# Altium project ARIA.PrjPcb
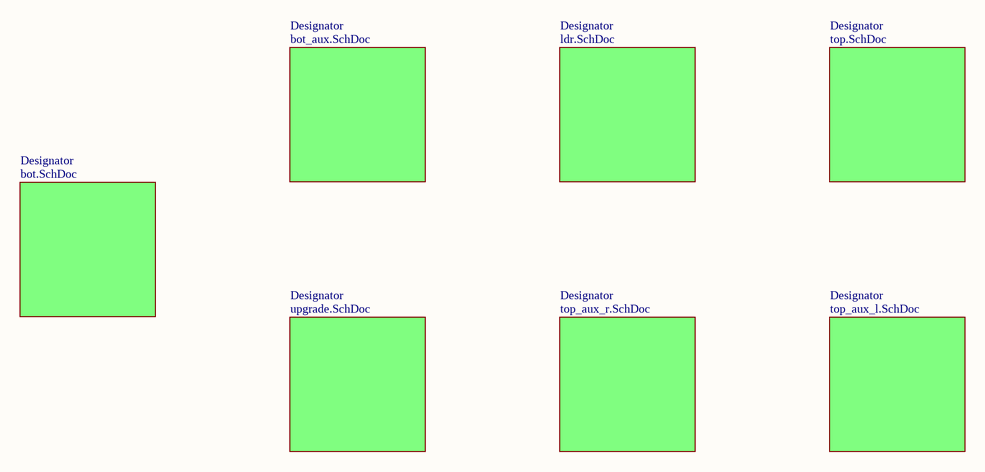
[diagram p0: master.SchDoc]
8 sheets, 96 parts. Net scope: flat (ports and power ports of the same name join across sheets).
Board files: master.PcbDoc, MadhurLDR.PcbDoc
Sheets:
  master.SchDoc
    Designator = bot_aux.SchDoc
    Designator = upgrade.SchDoc
    Designator = top_aux_r.SchDoc
    Designator = ldr.SchDoc
    Designator = top.SchDoc
    Designator = top_aux_l.SchDoc
    Designator = bot.SchDoc

## Sheet master.SchDoc
size A4; SheetNumber: 1; SheetTotal: 8

### Sub-sheets
Designator = bot_aux.SchDoc: no entries
Designator = upgrade.SchDoc: no entries
Designator = top_aux_r.SchDoc: no entries
Designator = ldr.SchDoc: no entries
Designator = top.SchDoc: no entries
Designator = top_aux_l.SchDoc: no entries
Designator = bot.SchDoc: no entries

## Sheet bot_aux.SchDoc
size A4; SheetNumber: 3; SheetTotal: 8
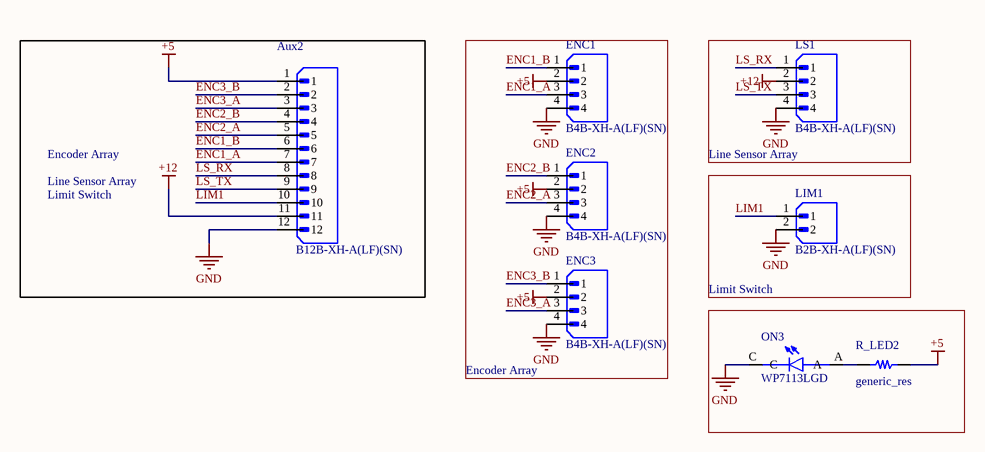
[diagram p1: bot_aux.SchDoc]

### Parts
Aux2  B12B-XH-A(LF)(SN)  [JST_B12B-XH-A(LF)(SN)]
ENC1  B4B-XH-A(LF)(SN)  [JST_B4B-XH-A(LF)(SN)]
ENC2  B4B-XH-A(LF)(SN)  [JST_B4B-XH-A(LF)(SN)]
ENC3  B4B-XH-A(LF)(SN)  [JST_B4B-XH-A(LF)(SN)]
LIM1  B2B-XH-A(LF)(SN)  [JST_B2B-XH-A(LF)(SN)]
LS1  B4B-XH-A(LF)(SN)  [JST_B4B-XH-A(LF)(SN)]
ON3  WP7113LGD  [LED_WP7113LGD]
R_LED2  generic_res  [generic_res_footprint]

### Blocks framed on the sheet
Encoder Array: ENC1-ENC3
Line Sensor Array: LS1
Limit Switch: LIM1

### Nets
+5: Aux2.1 ENC1.2 ENC2.2 ENC3.2 R_LED2.2
+12: Aux2.11 LS1.2
GND: Aux2.12 ENC1.4 ENC2.4 ENC3.4 LIM1.2 LS1.4 ON3.C
ENC1_A: Aux2.7 ENC1.3  [project net ENC1_A_3]
ENC1_B: Aux2.6 ENC1.1  [project net ENC1_B_3]
ENC2_A: Aux2.5 ENC2.3  [project net ENC2_A_3]
ENC2_B: Aux2.4 ENC2.1  [project net ENC2_B_3]
ENC3_A: Aux2.3 ENC3.3  [project net ENC3_A_3]
ENC3_B: Aux2.2 ENC3.1  [project net ENC3_B_3]
LIM1: Aux2.10 LIM1.1  [project net LIM1_3]
LS_RX: Aux2.8 LS1.1  [project net LS_RX_3]
LS_TX: Aux2.9 LS1.3  [project net LS_TX_3]
NetON3_A: ON3.A R_LED2.1

### Notes on the sheet
- Line Sensor Array
- Encoder Array
- Limit Switch

### Library data of the parts
Aux2 = CMP-398-000513-1: Connector Header Through Hole 12 position 0.098 (2.50mm); MF: JST Sales; Package: None; SnapEDA_Link: https://www.snapeda.com/parts/B12B-XH-A(LF)(SN)/JST+Sales+America+Inc./view-part/?ref=snap; Source: B12B-XH-A(LF)(SN).SchLib; Check_prices: https://www.snapeda.com/parts/B12B-XH-A(LF)(SN)/JST+Sales+America+Inc./view-part/?ref=eda; Value: *; Design Item ID: B12B-XH-A(LF)(SN); MP: B12B-XH-A(LF)(SN); Pin Count: 12; Component Type: Standard
ENC1-ENC3 LS1 = CMP-328-000000-1: Connector Header Through Hole 4 position 0.098 (2.50mm); MF: JST Sales; Pin Count: 4; Value: *; Check_prices: https://www.snapeda.com/parts/B4B-XH-A(LF)(SN)/JST+Sales+America+Inc./view-part/?ref=eda; SnapEDA_Link: https://www.snapeda.com/parts/B4B-XH-A(LF)(SN)/JST+Sales+America+Inc./view-part/?ref=snap; MP: B4B-XH-A(LF)(SN); Source: B4B-XH-A(LF)(SN).SchLib; Package: None; Component Type: Standard; Design Item ID: B4B-XH-A(LF)(SN)
LIM1 = CMP-332-000000-1: Connector Header Through Hole 2 position 0.098 (2.50mm); MF: JST Sales America Inc.; Component Type: Standard; Value: *; Check_prices: https://www.snapeda.com/parts/B2B-XH-A(LF)(SN)/JST+Sales+America+Inc./view-part/?ref=eda; Package: None; MP: B2B-XH-A(LF)(SN); SnapEDA_Link: https://www.snapeda.com/parts/B2B-XH-A(LF)(SN)/JST+Sales+America+Inc./view-part/?ref=snap; Pin Count: 2; Source: B2B-XH-A(LF)(SN).SchLib; Design Item ID: B2B-XH-A(LF)(SN)
ON3 = CMP-352-000000-1: Green 568nm LED Indication - Discrete 1.9V Radial; MF: Kingbright; Value: *; Component Type: Standard; Design Item ID: WP7113LGD; Package: Radial Kingbright; Price: None; Source: WP7113LGD.SchLib; SnapEDA_Link: https://www.snapeda.com/parts/WP7113LGD/Kingbright/view-part/?ref=snap; Check_prices: https://www.snapeda.com/parts/WP7113LGD/Kingbright/view-part/?ref=eda; Pin Count: 2; Availability: In Stock; Purchase-URL: https://pricing.snapeda.com/search/part/WP7113LGD/?ref=eda; MP: WP7113LGD
R_LED2 = CMP-340-000000-2: Generic through hole resistor

## Sheet upgrade.SchDoc
size A4; SheetNumber: 7; SheetTotal: 8
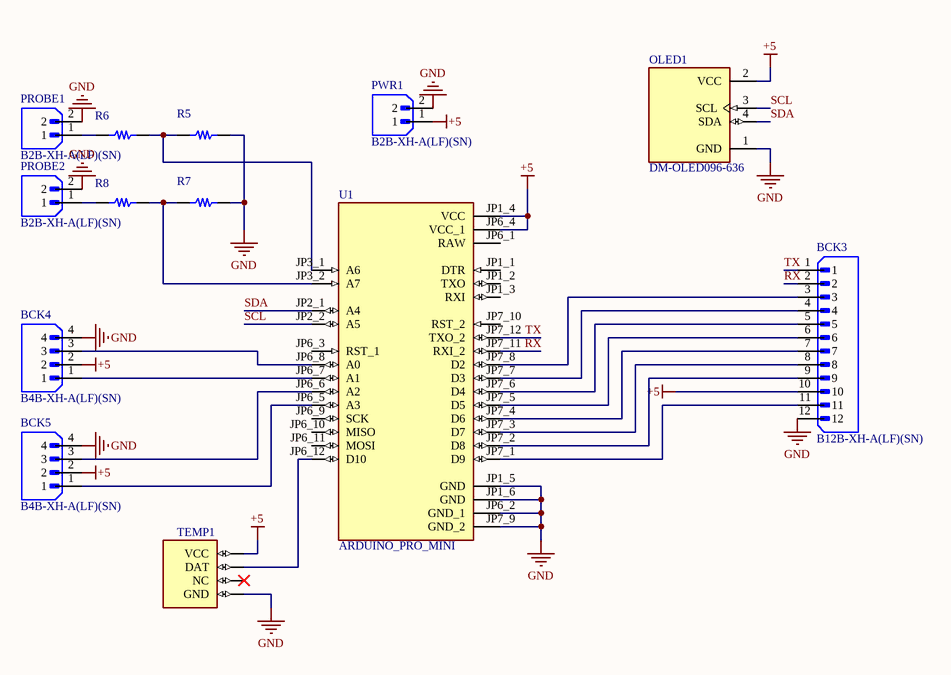
[diagram p2: upgrade.SchDoc]

### Parts
BCK3  B12B-XH-A(LF)(SN)  [JST_B12B-XH-A(LF)(SN)]
BCK4  B4B-XH-A(LF)(SN)  [JST_B4B-XH-A(LF)(SN)]
BCK5  B4B-XH-A(LF)(SN)  [JST_B4B-XH-A(LF)(SN)]
OLED1  DM-OLED096-636  [MODULE_DM-OLED096-636]
PROBE1  B2B-XH-A(LF)(SN)  [JST_B2B-XH-A(LF)(SN)]
PROBE2  B2B-XH-A(LF)(SN)  [JST_B2B-XH-A(LF)(SN)]
PWR1  B2B-XH-A(LF)(SN)  [JST_B2B-XH-A(LF)(SN)]
R5  generic_res  [generic_res_footprint]  (value not drawn)
R6  generic_res  [generic_res_footprint]  (value not drawn)
R7  generic_res  [generic_res_footprint]  (value not drawn)
R8  generic_res  [generic_res_footprint]  (value not drawn)
TEMP1  dht11_symbol  [dht11_footprint]  (value not drawn)
U1  ARDUINO_PRO_MINI  [MODULE_ARDUINO_PRO_MINI]

### Nets
+5: BCK3.10 BCK4.2 BCK5.2 OLED1.2(VCC) PWR1.1 TEMP1.1(VCC) U1.JP1_4(VCC) U1.JP6_4(VCC_1)
GND: BCK3.12 BCK4.4 BCK5.4 OLED1.1(GND) PROBE1.2 PROBE2.2 PWR1.2 R5.1 R7.1 TEMP1.4(GND) U1.JP1_5(GND) U1.JP1_6(GND) U1.JP6_2(GND_1) U1.JP7_9(GND_2)
RX: BCK3.2 U1.JP7_11(RXI_2)  [project net RX_7]
SCL: OLED1.3(SCL) U1.JP2_2(A5)  [project net SCL_7]
SDA: OLED1.4(SDA) U1.JP2_1(A4)  [project net SDA_7]
TX: BCK3.1 U1.JP7_12(TXO_2)  [project net TX_7]
NetBCK3_3: BCK3.3 U1.JP7_8(D2)
NetBCK3_4: BCK3.4 U1.JP7_7(D3)
NetBCK3_5: BCK3.5 U1.JP7_6(D4)
NetBCK3_6: BCK3.6 U1.JP7_5(D5)
NetBCK3_7: BCK3.7 U1.JP7_4(D6)
NetBCK3_8: BCK3.8 U1.JP7_3(D7)
NetBCK3_9: BCK3.9 U1.JP7_2(D8)
NetBCK3_11: BCK3.11 U1.JP7_1(D9)
NetBCK4_1: BCK4.1 U1.JP6_7(A1)
NetBCK4_3: BCK4.3 U1.JP6_8(A0)
NetBCK5_1: BCK5.1 U1.JP6_5(A3)
NetBCK5_3: BCK5.3 U1.JP6_6(A2)
NetPROBE1_1: PROBE1.1 R6.2
NetPROBE2_1: PROBE2.1 R8.2
NetR5_2: R5.2 R6.1 U1.JP3_1(A6)
NetR7_2: R7.2 R8.1 U1.JP3_2(A7)
NetTEMP1_2: TEMP1.2(DAT) U1.JP6_12(D10)

Not connected (* = marked no-connect by the designer): TEMP1 3(NC)*; U1 JP1_1(DTR) JP1_2(TXO) JP1_3(RXI) JP6_1(RAW) JP6_3(RST_1) JP6_9(SCK) JP6_10(MISO) JP6_11(MOSI) JP7_10(RST_2)

### Library data of the parts
BCK3 = CMP-398-000513-1: as Aux2 on sheet bot_aux; Package: None; SnapEDA_Link: https://www.snapeda.com/parts/B12B-XH-A(LF)(SN)/JST+Sales+America+Inc./view-part/?ref=snap; Source: B12B-XH-A(LF)(SN).SchLib; Check_prices: https://www.snapeda.com/parts/B12B-XH-A(LF)(SN)/JST+Sales+America+Inc./view-part/?ref=eda; Value: *; Design Item ID: B12B-XH-A(LF)(SN); MP: B12B-XH-A(LF)(SN); Pin Count: 12; Component Type: Standard
BCK4 BCK5 = CMP-328-000000-1: as ENC1 on sheet bot_aux; Pin Count: 4; Value: *; Check_prices: https://www.snapeda.com/parts/B4B-XH-A(LF)(SN)/JST+Sales+America+Inc./view-part/?ref=eda; SnapEDA_Link: https://www.snapeda.com/parts/B4B-XH-A(LF)(SN)/JST+Sales+America+Inc./view-part/?ref=snap; MP: B4B-XH-A(LF)(SN); Source: B4B-XH-A(LF)(SN).SchLib; Package: None; Component Type: Standard; Design Item ID: B4B-XH-A(LF)(SN)
OLED1 = CMP-410-000000-2: 128 X 64 Monochrome Graphic OLED Display Module; Check_prices: https://www.snapeda.com/parts/DM-OLED096-636/Display+Module/view-part/?ref=eda; Component Type: Standard; Design Item ID: DM-OLED096-636; Value: *; MF: Display Module; Pin Count: 4; SnapEDA_Link: https://www.snapeda.com/parts/DM-OLED096-636/Display+Module/view-part/?ref=snap; Source: DM-OLED096-636.SchLib; MP: DM-OLED096-636; Package: Package
PROBE1 PROBE2 PWR1 = CMP-332-000000-1: as LIM1 on sheet bot_aux; Component Type: Standard; Value: *; Check_prices: https://www.snapeda.com/parts/B2B-XH-A(LF)(SN)/JST+Sales+America+Inc./view-part/?ref=eda; Package: None; MP: B2B-XH-A(LF)(SN); SnapEDA_Link: https://www.snapeda.com/parts/B2B-XH-A(LF)(SN)/JST+Sales+America+Inc./view-part/?ref=snap; Pin Count: 2; Source: B2B-XH-A(LF)(SN).SchLib; Design Item ID: B2B-XH-A(LF)(SN)
R5-R8 = CMP-340-000000-2: Generic through hole resistor
TEMP1 = CMP-00054-3: Humidity, Temperature Digital Â±5% RH Through Hole; MF: UNIVERSAL-SOLDER Electronics Ltd; MP: DHT11; Source: DHT11.SchLib; Pin Count: 3; Component Type: Standard; Package: None; Check_prices: https://www.snapeda.com/parts/DHT11/Ersa/view-part/?ref=eda; Design Item ID: DHT11; SnapEDA_Link: https://www.snapeda.com/parts/DHT11/Ersa/view-part/?ref=snap; Value: *
U1 = CMP-412-000000-1: This board was developed for applications and installations where space is premium and projects are made as permanent set ups. Small, available in 3.3 V and 5 V versions, powered by ATmega328P.; MP: Arduino Pro Mini; Component Type: Standard; Value: *; Pin Count: 34; Check_prices: https://www.snapeda.com/parts/Arduino%20Pro%20Mini/Arduino/view-part/?ref=eda; Package: None; Design Item ID: ARDUINO_PRO_MINI; Source: ARDUINO_PRO_MINI.SchLib; MF: Arduino; SnapEDA_Link: https://www.snapeda.com/parts/Arduino%20Pro%20Mini/Arduino/view-part/?ref=snap

## Sheet top_aux_r.SchDoc
size A4; SheetNumber: 8; SheetTotal: 8
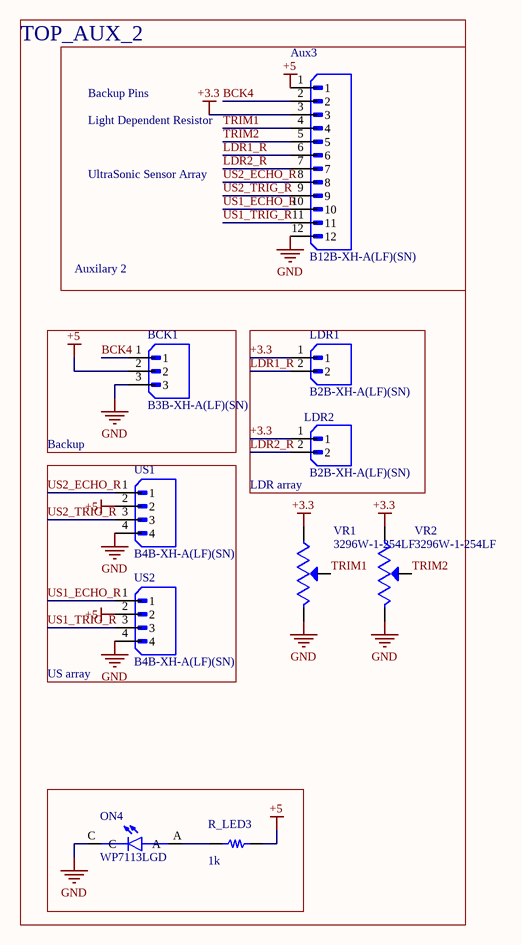
[diagram p3: top_aux_r.SchDoc]

### Parts
(Parts that share a designator on the sheet are numbered #1, #2 ... from top to bottom, then left to right.)
Aux3  B12B-XH-A(LF)(SN)  [JST_B12B-XH-A(LF)(SN)]
BCK1  B3B-XH-A(LF)(SN)  [JST_B3B-XH-A(LF)(SN)]
LDR1#1  B2B-XH-A(LF)(SN)  [JST_B2B-XH-A(LF)(SN)]
LDR2#1  B2B-XH-A(LF)(SN)  [JST_B2B-XH-A(LF)(SN)]
ON4  WP7113LGD  [LED_WP7113LGD]
R_LED3  1k  [generic_res_footprint]
US1  B4B-XH-A(LF)(SN)  [JST_B4B-XH-A(LF)(SN)]
US2  B4B-XH-A(LF)(SN)  [JST_B4B-XH-A(LF)(SN)]
VR1  3296W-1-254LF  [TRIM_3296W-1-254LF]
VR2  3296W-1-254LF  [TRIM_3296W-1-254LF]

### Blocks framed on the sheet
TOP_AUX_2: Aux3 ON4 R_LED3 VR1 VR2
Backup: BCK1
LDR array: LDR1#1 LDR2#1
US array: US1 US2

### Nets
+3.3: Aux3.3 LDR1#1.1 LDR2#1.1 VR1.1(CCW) VR2.1(CCW)
+5: Aux3.1 BCK1.2 R_LED3.2 US1.2 US2.2
GND: Aux3.12 BCK1.3 ON4.C US1.4 US2.4 VR1.3(CW) VR2.3(CW)
BCK4: Aux3.2 BCK1.1  [project net BCK4_8]
LDR1_R: Aux3.6 LDR1#1.2  [project net LDR1_R_8]
LDR2_R: Aux3.7 LDR2#1.2  [project net LDR2_R_8]
TRIM1: Aux3.4 VR1.2(WIPER)  [project net TRIM1_8]
TRIM2: Aux3.5 VR2.2(WIPER)  [project net TRIM2_8]
US1_ECHO_R: Aux3.10 US2.1  [project net US1_ECHO_R_8]
US1_TRIG_R: Aux3.11 US2.3  [project net US1_TRIG_R_8]
US2_ECHO_R: Aux3.8 US1.1  [project net US2_ECHO_R_8]
US2_TRIG_R: Aux3.9 US1.3  [project net US2_TRIG_R_8]
NetON4_A: ON4.A R_LED3.1

### Notes on the sheet
- Backup Pins
- Light Dependent Resistor
- UltraSonic Sensor Array
- Auxilary 2

### Library data of the parts
Aux3 = CMP-398-000513-1: as Aux2 on sheet bot_aux; Package: None; SnapEDA_Link: https://www.snapeda.com/parts/B12B-XH-A(LF)(SN)/JST+Sales+America+Inc./view-part/?ref=snap; Source: B12B-XH-A(LF)(SN).SchLib; Check_prices: https://www.snapeda.com/parts/B12B-XH-A(LF)(SN)/JST+Sales+America+Inc./view-part/?ref=eda; Value: *; Design Item ID: B12B-XH-A(LF)(SN); MP: B12B-XH-A(LF)(SN); Pin Count: 12; Component Type: Standard
BCK1 = CMP-330-000000-1: Connector Header Through Hole 3 position 0.098 (2.50mm); MF: JST Sales; Value: *; Check_prices: https://www.snapeda.com/parts/B3B-XH-A(LF)(SN)/JST+Sales+America+Inc./view-part/?ref=eda; Component Type: Standard; Source: B3B-XH-A(LF)(SN).SchLib; MP: B3B-XH-A(LF)(SN); Design Item ID: B3B-XH-A(LF)(SN); SnapEDA_Link: https://www.snapeda.com/parts/B3B-XH-A(LF)(SN)/JST+Sales+America+Inc./view-part/?ref=snap; Pin Count: 3; Package: None
LDR1#1 LDR2#1 = CMP-332-000000-1: as LIM1 on sheet bot_aux; Component Type: Standard; Value: *; Check_prices: https://www.snapeda.com/parts/B2B-XH-A(LF)(SN)/JST+Sales+America+Inc./view-part/?ref=eda; Package: None; MP: B2B-XH-A(LF)(SN); SnapEDA_Link: https://www.snapeda.com/parts/B2B-XH-A(LF)(SN)/JST+Sales+America+Inc./view-part/?ref=snap; Pin Count: 2; Source: B2B-XH-A(LF)(SN).SchLib; Design Item ID: B2B-XH-A(LF)(SN)
ON4 = CMP-352-000000-1: as ON3 on sheet bot_aux; Value: *; Component Type: Standard; Design Item ID: WP7113LGD; Package: Radial Kingbright; Price: None; Source: WP7113LGD.SchLib; SnapEDA_Link: https://www.snapeda.com/parts/WP7113LGD/Kingbright/view-part/?ref=snap; Check_prices: https://www.snapeda.com/parts/WP7113LGD/Kingbright/view-part/?ref=eda; Pin Count: 2; Availability: In Stock; Purchase-URL: https://pricing.snapeda.com/search/part/WP7113LGD/?ref=eda; MP: WP7113LGD
R_LED3 = CMP-340-000000-2: Generic through hole resistor
US1 US2 = CMP-328-000000-1: as ENC1 on sheet bot_aux; Pin Count: 4; Value: *; Check_prices: https://www.snapeda.com/parts/B4B-XH-A(LF)(SN)/JST+Sales+America+Inc./view-part/?ref=eda; SnapEDA_Link: https://www.snapeda.com/parts/B4B-XH-A(LF)(SN)/JST+Sales+America+Inc./view-part/?ref=snap; MP: B4B-XH-A(LF)(SN); Source: B4B-XH-A(LF)(SN).SchLib; Package: None; Component Type: Standard; Design Item ID: B4B-XH-A(LF)(SN)
VR1 VR2 = CMP-402-000001-1: 250 kOhms 0.5W, 1/2W PC Pins Through Hole Trimmer Potentiometer Cermet 25.0 Turn Top Adjustment; MF: Bourns; Source: 3296W-1-254LF.SchLib; Purchase-URL: https://pricing.snapeda.com/search/part/3296W-1-254LF/?ref=eda; Value: *; Price: None; MP: 3296W-1-254LF; Availability: In Stock; Pin Count: 3; Check_prices: https://www.snapeda.com/parts/3296W-1-254LF/Bourns+-+J.W.+Miller/view-part/?ref=eda; Design Item ID: 3296W-1-254LF; Component Type: Standard; SnapEDA_Link: https://www.snapeda.com/parts/3296W-1-254LF/Bourns+-+J.W.+Miller/view-part/?ref=snap; Package: SOT-23-5 Bourns

## Sheet ldr.SchDoc
size A4; SheetNumber: 6; SheetTotal: 8
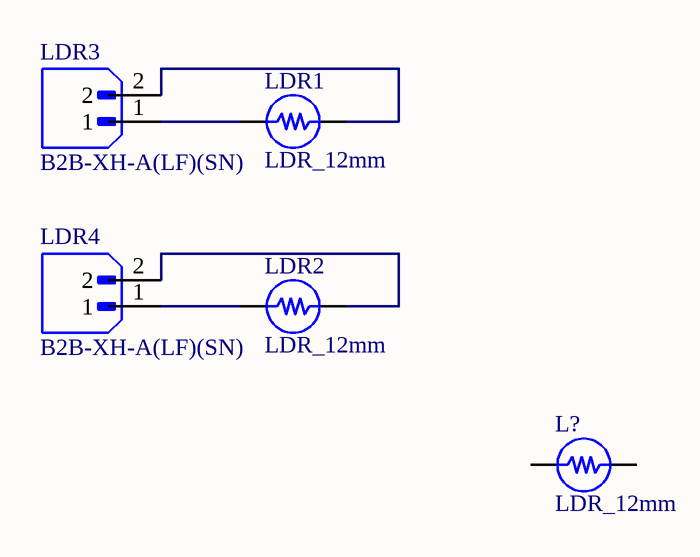
[diagram p4: ldr.SchDoc]

### Parts
(Parts that share a designator on the sheet are numbered #1, #2 ... from top to bottom, then left to right.)
L?  LDR_12mm  [LDR_12mm-Footprint-1]
LDR1#2  LDR_12mm  [LDR_12mm-Footprint-1]
LDR2#2  LDR_12mm  [LDR_12mm-Footprint-1]
LDR3  B2B-XH-A(LF)(SN)  [JST_B2B-XH-A(LF)(SN)]
LDR4  B2B-XH-A(LF)(SN)  [JST_B2B-XH-A(LF)(SN)]

### Nets
NetLDR1#2_1: LDR1#2.1 LDR3.1
NetLDR1#2_2: LDR1#2.2 LDR3.2
NetLDR2#2_1: LDR2#2.1 LDR4.1
NetLDR2#2_2: LDR2#2.2 LDR4.2

Not connected (* = marked no-connect by the designer): L? 1 2

### Library data of the parts
L? LDR1#2 LDR2#2 = CMP-00057-1: 12mm Light Dependant Resistor
LDR3 LDR4 = CMP-332-000000-1: as LIM1 on sheet bot_aux; Component Type: Standard; Value: *; Check_prices: https://www.snapeda.com/parts/B2B-XH-A(LF)(SN)/JST+Sales+America+Inc./view-part/?ref=eda; Package: None; MP: B2B-XH-A(LF)(SN); SnapEDA_Link: https://www.snapeda.com/parts/B2B-XH-A(LF)(SN)/JST+Sales+America+Inc./view-part/?ref=snap; Pin Count: 2; Source: B2B-XH-A(LF)(SN).SchLib; Design Item ID: B2B-XH-A(LF)(SN)

## Sheet top.SchDoc
size 381 x 241 mm; SheetNumber: 4; SheetTotal: 8
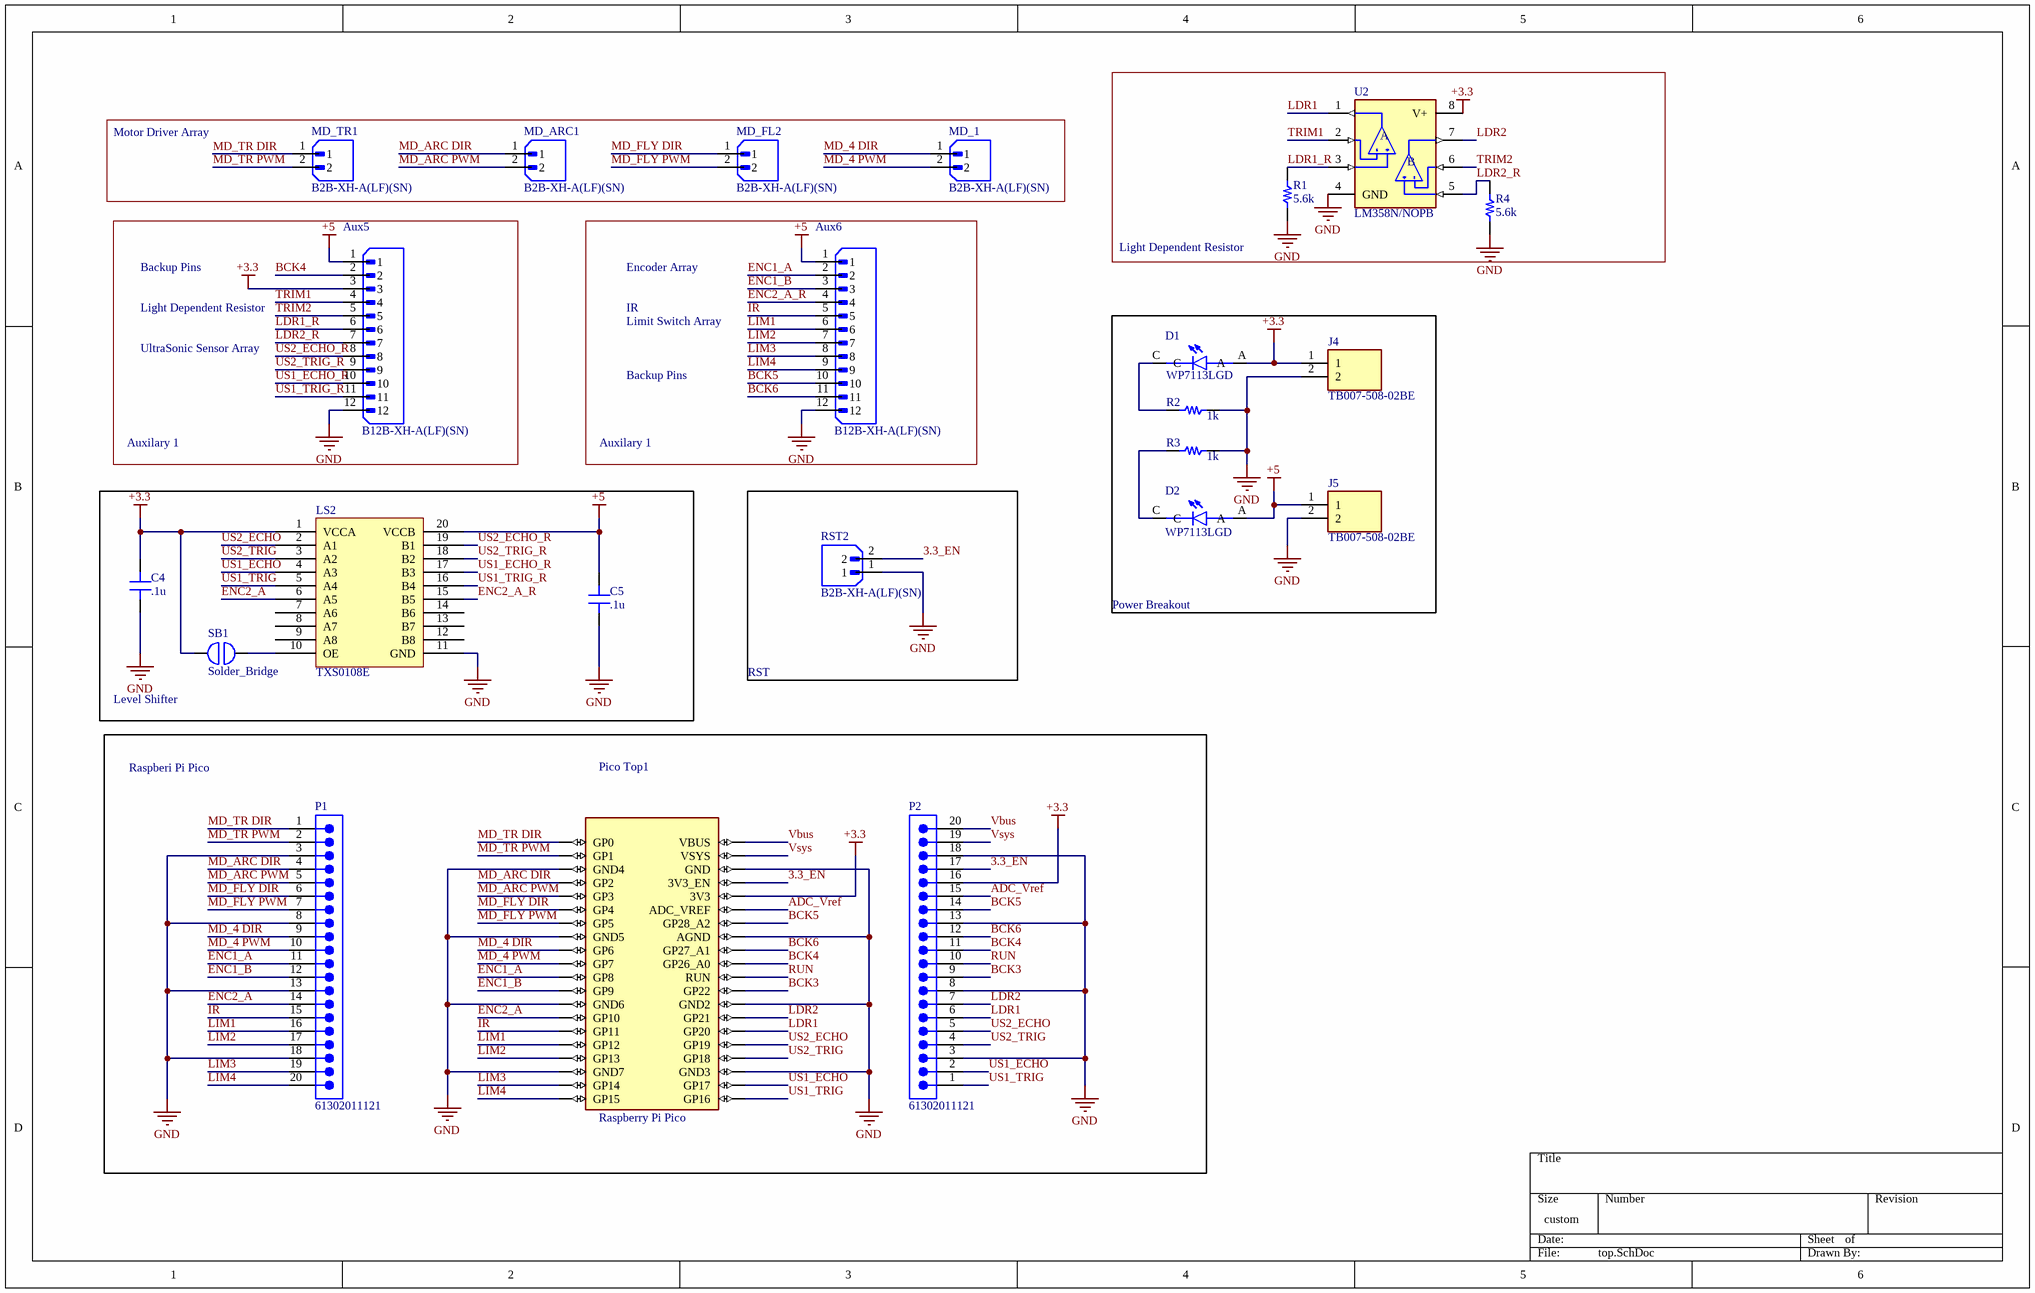
[diagram p5: top.SchDoc]

### Parts
Aux5  B12B-XH-A(LF)(SN)  [JST_B12B-XH-A(LF)(SN)]
Aux6  B12B-XH-A(LF)(SN)  [JST_B12B-XH-A(LF)(SN)]
C4  .1u  [generic_cap]
C5  .1u  [generic_cap]
D1  WP7113LGD  [LED_WP7113LGD]
D2  WP7113LGD  [LED_WP7113LGD]
J4  TB007-508-02BE  [CUI_TB007-508-02BE]
J5  TB007-508-02BE  [CUI_TB007-508-02BE]
LS2  TXS0108E  [TXS0108E footprint]
MD_1  B2B-XH-A(LF)(SN)  [JST_B2B-XH-A(LF)(SN)]
MD_ARC1  B2B-XH-A(LF)(SN)  [JST_B2B-XH-A(LF)(SN)]
MD_FL2  B2B-XH-A(LF)(SN)  [JST_B2B-XH-A(LF)(SN)]
MD_TR1  B2B-XH-A(LF)(SN)  [JST_B2B-XH-A(LF)(SN)]
P1  61302011121  [61302011121]
P2  61302011121  [61302011121]
Pico_Top1  Raspberry Pi Pico  [RASPBERRY_PI_PICO]
R1  5.6k  [generic_res_footprint]
R2  1k  [generic_res_footprint]
R3  1k  [generic_res_footprint]
R4  5.6k  [generic_res_footprint]
RST2  B2B-XH-A(LF)(SN)  [JST_B2B-XH-A(LF)(SN)]
SB1  Solder_Bridge  [Solder_Bridge-Footprint-1]
U2  LM358N/NOPB  [DIP794W45P254L959H508Q8]

### Blocks framed on the sheet
Motor Driver Array: MD_1 MD_ARC1 MD_FL2 MD_TR1
Light Dependent Resistor: R1 R4 U2
Power Breakout: D1 D2 J4 J5 R2 R3
Level Shifter: C4 C5 LS2 SB1
RST: RST2
Raspberi Pi Pico: P1 P2 Pico_Top1

### Nets
+3.3: Aux5.3 C4.2 D1.A J4.1 LS2.1(VCCA) P2.16 Pico_Top1.3V3 SB1.1 U2.8(V+)
+5: Aux5.1 Aux6.1 C5.2 D2.A J5.1 LS2.20(VCCB)
GND: Aux5.12 Aux6.12 C4.1 C5.1 J4.2 J5.2 LS2.11(GND) P1.3 P1.8 P1.13 P1.18 P2.3 P2.8 P2.13 P2.18 Pico_Top1.AGND Pico_Top1.GND Pico_Top1.GND2 Pico_Top1.GND3 Pico_Top1.GND4 Pico_Top1.GND5 Pico_Top1.GND6 Pico_Top1.GND7 R1.1 R2.2 R3.2 R4.1 RST2.1 U2.4(GND)
3.3_EN: P2.17 Pico_Top1.3V3_EN RST2.2  [project net 3.3_EN_4]
ADC_Vref: P2.15 Pico_Top1.ADC_VREF  [project net ADC_Vref_4]
BCK3: P2.9 Pico_Top1.GP22  [project net BCK3_4]
BCK4: Aux5.2 P2.11 Pico_Top1.GP26_A0  [project net BCK4_4]
BCK5: Aux6.10 P2.14 Pico_Top1.GP28_A2  [project net BCK5_4]
BCK6: Aux6.11 P2.12 Pico_Top1.GP27_A1  [project net BCK6_4]
ENC1_A: Aux6.2 P1.11 Pico_Top1.GP8  [project net ENC1_A_4]
ENC1_B: Aux6.3 P1.12 Pico_Top1.GP9  [project net ENC1_B_4]
ENC2_A: LS2.6(A5) P1.14 Pico_Top1.GP10  [project net ENC2_A_4]
ENC2_A_R: Aux6.4 LS2.15(B5)  [project net ENC2_A_R_4]
IR: Aux6.5 P1.15 Pico_Top1.GP11  [project net IR_4]
LDR1: P2.6 Pico_Top1.GP20 U2.1(OUTA)  [project net LDR1_4]
LDR1_R: Aux5.6 R1.2 U2.3(+INA)  [project net LDR1_R_4]
LDR2: P2.7 Pico_Top1.GP21 U2.7(OUTB)  [project net LDR2_4]
LDR2_R: Aux5.7 R4.2 U2.5(+INB)  [project net LDR2_R_4]
LIM1: Aux6.6 P1.16 Pico_Top1.GP12  [project net LIM1_4]
LIM2: Aux6.7 P1.17 Pico_Top1.GP13  [project net LIM2_4]
LIM3: Aux6.8 P1.19 Pico_Top1.GP14  [project net LIM3_4]
LIM4: Aux6.9 P1.20 Pico_Top1.GP15  [project net LIM4_4]
MD_4 DIR: MD_1.1 P1.9 Pico_Top1.GP6  [project net MD_4 DIR_4]
MD_4 PWM: MD_1.2 P1.10 Pico_Top1.GP7  [project net MD_4 PWM_4]
MD_ARC DIR: MD_ARC1.1 P1.4 Pico_Top1.GP2  [project net MD_ARC DIR_4]
MD_ARC PWM: MD_ARC1.2 P1.5 Pico_Top1.GP3  [project net MD_ARC PWM_4]
MD_FLY DIR: MD_FL2.1 P1.6 Pico_Top1.GP4  [project net MD_FLY DIR_4]
MD_FLY PWM: MD_FL2.2 P1.7 Pico_Top1.GP5  [project net MD_FLY PWM_4]
MD_TR DIR: MD_TR1.1 P1.1 Pico_Top1.GP0  [project net MD_TR DIR_4]
MD_TR PWM: MD_TR1.2 P1.2 Pico_Top1.GP1  [project net MD_TR PWM_4]
RUN: P2.10 Pico_Top1.RUN  [project net RUN_4]
TRIM1: Aux5.4 U2.2(-INA)  [project net TRIM1_4]
TRIM2: Aux5.5 U2.6(-INB)  [project net TRIM2_4]
US1_ECHO: LS2.4(A3) P2.2 Pico_Top1.GP17  [project net US1_ECHO_4]
US1_ECHO_R: Aux5.10 LS2.17(B3)  [project net US1_ECHO_R_4]
US1_TRIG: LS2.5(A4) P2.1 Pico_Top1.GP16  [project net US1_TRIG_4]
US1_TRIG_R: Aux5.11 LS2.16(B4)  [project net US1_TRIG_R_4]
US2_ECHO: LS2.2(A1) P2.5 Pico_Top1.GP19  [project net US2_ECHO_4]
US2_ECHO_R: Aux5.8 LS2.19(B1)  [project net US2_ECHO_R_4]
US2_TRIG: LS2.3(A2) P2.4 Pico_Top1.GP18  [project net US2_TRIG_4]
US2_TRIG_R: Aux5.9 LS2.18(B2)  [project net US2_TRIG_R_4]
Vbus: P2.20 Pico_Top1.VBUS  [project net Vbus_4]
Vsys: P2.19 Pico_Top1.VSYS  [project net Vsys_4]
NetD1_C: D1.C R2.1
NetD2_C: D2.C R3.1
NetLS2_10: LS2.10(OE) SB1.2

Not connected (* = marked no-connect by the designer): LS2 7(A6) 8(A7) 9(A8) 12(B8) 13(B7) 14(B6)

### Notes on the sheet
- Backup Pins
- Encoder Array
- UltraSonic Sensor Array
- Light Dependent Resistor
- Limit Switch Array
- IR
- Auxilary 1
- (in symbol CMP-416-000000-1) A; B

### Library data of the parts
Aux5 Aux6 = CMP-398-000513-1: as Aux2 on sheet bot_aux; Package: None; SnapEDA_Link: https://www.snapeda.com/parts/B12B-XH-A(LF)(SN)/JST+Sales+America+Inc./view-part/?ref=snap; Source: B12B-XH-A(LF)(SN).SchLib; Check_prices: https://www.snapeda.com/parts/B12B-XH-A(LF)(SN)/JST+Sales+America+Inc./view-part/?ref=eda; Value: *; Design Item ID: B12B-XH-A(LF)(SN); MP: B12B-XH-A(LF)(SN); Pin Count: 12; Component Type: Standard
C4 C5 = CMP-396-000000-3: Generic Ceramic Capacitor; MP: RDER71H472K0K1H03B; Price: None; Package: None; Value: *; Source: RDER71H472K0K1H03B.SchLib; Design Item ID: RDER71H472K0K1H03B; Pin Count: 2; Component Type: Standard; Availability: Unavailable
D1 D2 = CMP-352-000000-1: as ON3 on sheet bot_aux; Value: *; Component Type: Standard; Design Item ID: WP7113LGD; Package: Radial Kingbright; Price: None; Source: WP7113LGD.SchLib; SnapEDA_Link: https://www.snapeda.com/parts/WP7113LGD/Kingbright/view-part/?ref=snap; Check_prices: https://www.snapeda.com/parts/WP7113LGD/Kingbright/view-part/?ref=eda; Pin Count: 2; Availability: In Stock; Purchase-URL: https://pricing.snapeda.com/search/part/WP7113LGD/?ref=eda; MP: WP7113LGD
J4 J5 = CMP-390-000000-3: Barrier Strip Terminal Block; MF: {'manufacturer': u'CUI'}; Source: TB007-508-02BE.SchLib; Component Type: Standard; Design Item ID: TB007-508-02BE; Availability: Unavailable; Value: *; Price: None; Pin Count: 2; MP: TB007-508-02BE; Package: None
LS2 = CMP-00015-2: 8 Channel Logic Level Shifter module
MD_1 MD_ARC1 MD_FL2 MD_TR1 RST2 = CMP-332-000000-1: as LIM1 on sheet bot_aux; Component Type: Standard; Value: *; Check_prices: https://www.snapeda.com/parts/B2B-XH-A(LF)(SN)/JST+Sales+America+Inc./view-part/?ref=eda; Package: None; MP: B2B-XH-A(LF)(SN); SnapEDA_Link: https://www.snapeda.com/parts/B2B-XH-A(LF)(SN)/JST+Sales+America+Inc./view-part/?ref=snap; Pin Count: 2; Source: B2B-XH-A(LF)(SN).SchLib; Design Item ID: B2B-XH-A(LF)(SN)
P1 P2 = CMP-398-000243-1: WR-PHD Pin Header, THT, Vertical, pitch 2.54mm, 1 Row, 20P; Manufacturer: Wurth Elektronik; Withstanding Voltage: 500V; Working Voltage: 250V; Rated Current: 3A; Contact Resistance: 20mOhm; ComponentLink2URL: https://www.we-online.com/redexpert/spec/61302011121?ad; Packaging: Bag; Orientation: Vertical; Match Code: WR-PHD; Number of Pins: 20; Number of Rows: 1; Gender: Pin Header; Source: WR-PHD.SchLib; Design Item ID: 61302011121; ComponentLink1Description: Website Link; Operating Temperature Min: -40°C; Manufacturer Part Number: 61302011121; ComponentLink2Description: Datasheet Link; ComponentLink1URL: https://www.we-online.com/redexpert/article/61302011121?ad; Operating Temperature Max: 105°C; Component Type: Standard; Mount: Through Hole; Category: Board-to-Board Connectors; Pin Count: 20; Pitch: 2.54mm
Pico_Top1 = CMP-394-000000-2: Raspberry Pi Board, Arm Cortex-M0+; Component Type: Standard; MF: Raspberry Pi; Design Item ID: RASPBERRY_PI_PICO; MP: RASPBERRY PI PICO; SnapEDA_Link: https://www.snapeda.com/parts/RASPBERRY%20PI%20PICO/Raspberry+Pi/view-part/?ref=snap; Check_prices: https://www.snapeda.com/parts/RASPBERRY%20PI%20PICO/Raspberry+Pi/view-part/?ref=eda; Package: None; Source: RASPBERRY_PI_PICO.SchLib; Pin Count: 40; Value: *
R1-R4 = CMP-340-000000-2: Generic through hole resistor
SB1 = CMP-00024-5: Solder bridge component
U2 = CMP-416-000000-1: General Purpose Amplifier 2 Circuit - 8-PDIP; MP: LM358N; MF: ON Semiconductor; Pin Count: 8; Component Type: Standard; Check_prices: https://www.snapeda.com/parts/LM358N/Onsemi/view-part/?ref=eda; Package: PDIP-8 ON Semiconductor; Value: *; Source: LM358N_NOPB.SchLib; SnapEDA_Link: https://www.snapeda.com/parts/LM358N/Onsemi/view-part/?ref=snap; Design Item ID: LM358N/NOPB

## Sheet top_aux_l.SchDoc
size A4; SheetNumber: 5; SheetTotal: 8
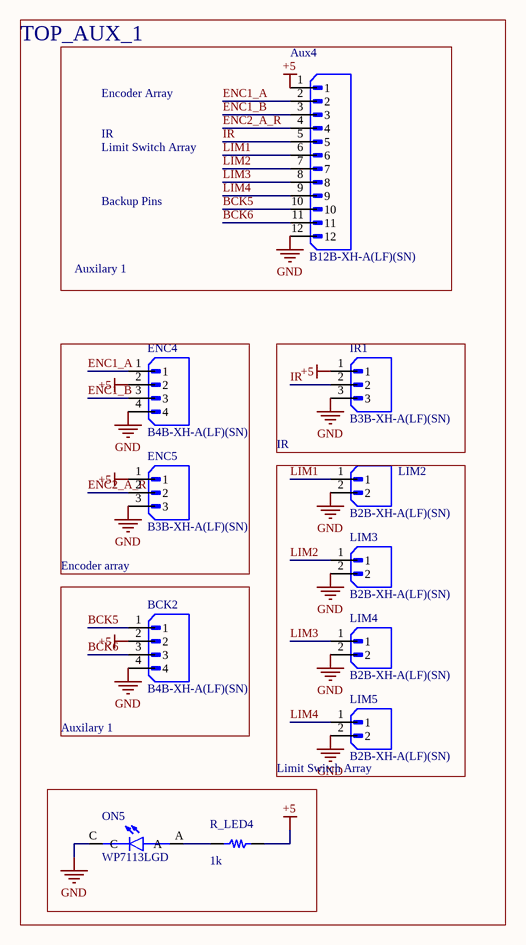
[diagram p6: top_aux_l.SchDoc]

### Parts
Aux4  B12B-XH-A(LF)(SN)  [JST_B12B-XH-A(LF)(SN)]
BCK2  B4B-XH-A(LF)(SN)  [JST_B4B-XH-A(LF)(SN)]
ENC4  B4B-XH-A(LF)(SN)  [JST_B4B-XH-A(LF)(SN)]
ENC5  B3B-XH-A(LF)(SN)  [JST_B3B-XH-A(LF)(SN)]
IR1  B3B-XH-A(LF)(SN)  [JST_B3B-XH-A(LF)(SN)]
LIM2  B2B-XH-A(LF)(SN)  [JST_B2B-XH-A(LF)(SN)]
LIM3  B2B-XH-A(LF)(SN)  [JST_B2B-XH-A(LF)(SN)]
LIM4  B2B-XH-A(LF)(SN)  [JST_B2B-XH-A(LF)(SN)]
LIM5  B2B-XH-A(LF)(SN)  [JST_B2B-XH-A(LF)(SN)]
ON5  WP7113LGD  [LED_WP7113LGD]
R_LED4  1k  [generic_res_footprint]

### Blocks framed on the sheet
TOP_AUX_1: Aux4 BCK2 LIM2-LIM5
Encoder array: ENC4 ENC5
IR: IR1
Limit Switch Array: ON5 R_LED4

### Nets
+5: Aux4.1 BCK2.2 ENC4.2 ENC5.1 IR1.1 R_LED4.2
GND: Aux4.12 BCK2.4 ENC4.4 ENC5.3 IR1.3 LIM2.2 LIM3.2 LIM4.2 LIM5.2 ON5.C
BCK5: Aux4.10 BCK2.1  [project net BCK5_5]
BCK6: Aux4.11 BCK2.3  [project net BCK6_5]
ENC1_A: Aux4.2 ENC4.1  [project net ENC1_A_5]
ENC1_B: Aux4.3 ENC4.3  [project net ENC1_B_5]
ENC2_A_R: Aux4.4 ENC5.2  [project net ENC2_A_R_5]
IR: Aux4.5 IR1.2  [project net IR_5]
LIM1: Aux4.6 LIM2.1  [project net LIM1_5]
LIM2: Aux4.7 LIM3.1  [project net LIM2_5]
LIM3: Aux4.8 LIM4.1  [project net LIM3_5]
LIM4: Aux4.9 LIM5.1  [project net LIM4_5]
NetON5_A: ON5.A R_LED4.1

### Notes on the sheet
- Encoder Array
- IR
- Limit Switch Array
- Backup Pins
- Auxilary 1

### Library data of the parts
Aux4 = CMP-398-000513-1: as Aux2 on sheet bot_aux; Package: None; SnapEDA_Link: https://www.snapeda.com/parts/B12B-XH-A(LF)(SN)/JST+Sales+America+Inc./view-part/?ref=snap; Source: B12B-XH-A(LF)(SN).SchLib; Check_prices: https://www.snapeda.com/parts/B12B-XH-A(LF)(SN)/JST+Sales+America+Inc./view-part/?ref=eda; Value: *; Design Item ID: B12B-XH-A(LF)(SN); MP: B12B-XH-A(LF)(SN); Pin Count: 12; Component Type: Standard
BCK2 ENC4 = CMP-328-000000-1: as ENC1 on sheet bot_aux; Pin Count: 4; Value: *; Check_prices: https://www.snapeda.com/parts/B4B-XH-A(LF)(SN)/JST+Sales+America+Inc./view-part/?ref=eda; SnapEDA_Link: https://www.snapeda.com/parts/B4B-XH-A(LF)(SN)/JST+Sales+America+Inc./view-part/?ref=snap; MP: B4B-XH-A(LF)(SN); Source: B4B-XH-A(LF)(SN).SchLib; Package: None; Component Type: Standard; Design Item ID: B4B-XH-A(LF)(SN)
ENC5 IR1 = CMP-330-000000-1: as BCK1 on sheet top_aux_r; Value: *; Check_prices: https://www.snapeda.com/parts/B3B-XH-A(LF)(SN)/JST+Sales+America+Inc./view-part/?ref=eda; Component Type: Standard; Source: B3B-XH-A(LF)(SN).SchLib; MP: B3B-XH-A(LF)(SN); Design Item ID: B3B-XH-A(LF)(SN); SnapEDA_Link: https://www.snapeda.com/parts/B3B-XH-A(LF)(SN)/JST+Sales+America+Inc./view-part/?ref=snap; Pin Count: 3; Package: None
LIM2-LIM5 = CMP-332-000000-1: as LIM1 on sheet bot_aux; Component Type: Standard; Value: *; Check_prices: https://www.snapeda.com/parts/B2B-XH-A(LF)(SN)/JST+Sales+America+Inc./view-part/?ref=eda; Package: None; MP: B2B-XH-A(LF)(SN); SnapEDA_Link: https://www.snapeda.com/parts/B2B-XH-A(LF)(SN)/JST+Sales+America+Inc./view-part/?ref=snap; Pin Count: 2; Source: B2B-XH-A(LF)(SN).SchLib; Design Item ID: B2B-XH-A(LF)(SN)
ON5 = CMP-352-000000-1: as ON3 on sheet bot_aux; Value: *; Component Type: Standard; Design Item ID: WP7113LGD; Package: Radial Kingbright; Price: None; Source: WP7113LGD.SchLib; SnapEDA_Link: https://www.snapeda.com/parts/WP7113LGD/Kingbright/view-part/?ref=snap; Check_prices: https://www.snapeda.com/parts/WP7113LGD/Kingbright/view-part/?ref=eda; Pin Count: 2; Availability: In Stock; Purchase-URL: https://pricing.snapeda.com/search/part/WP7113LGD/?ref=eda; MP: WP7113LGD
R_LED4 = CMP-340-000000-2: Generic through hole resistor

## Sheet bot.SchDoc
size 431 x 241 mm; SheetNumber: 2; SheetTotal: 8
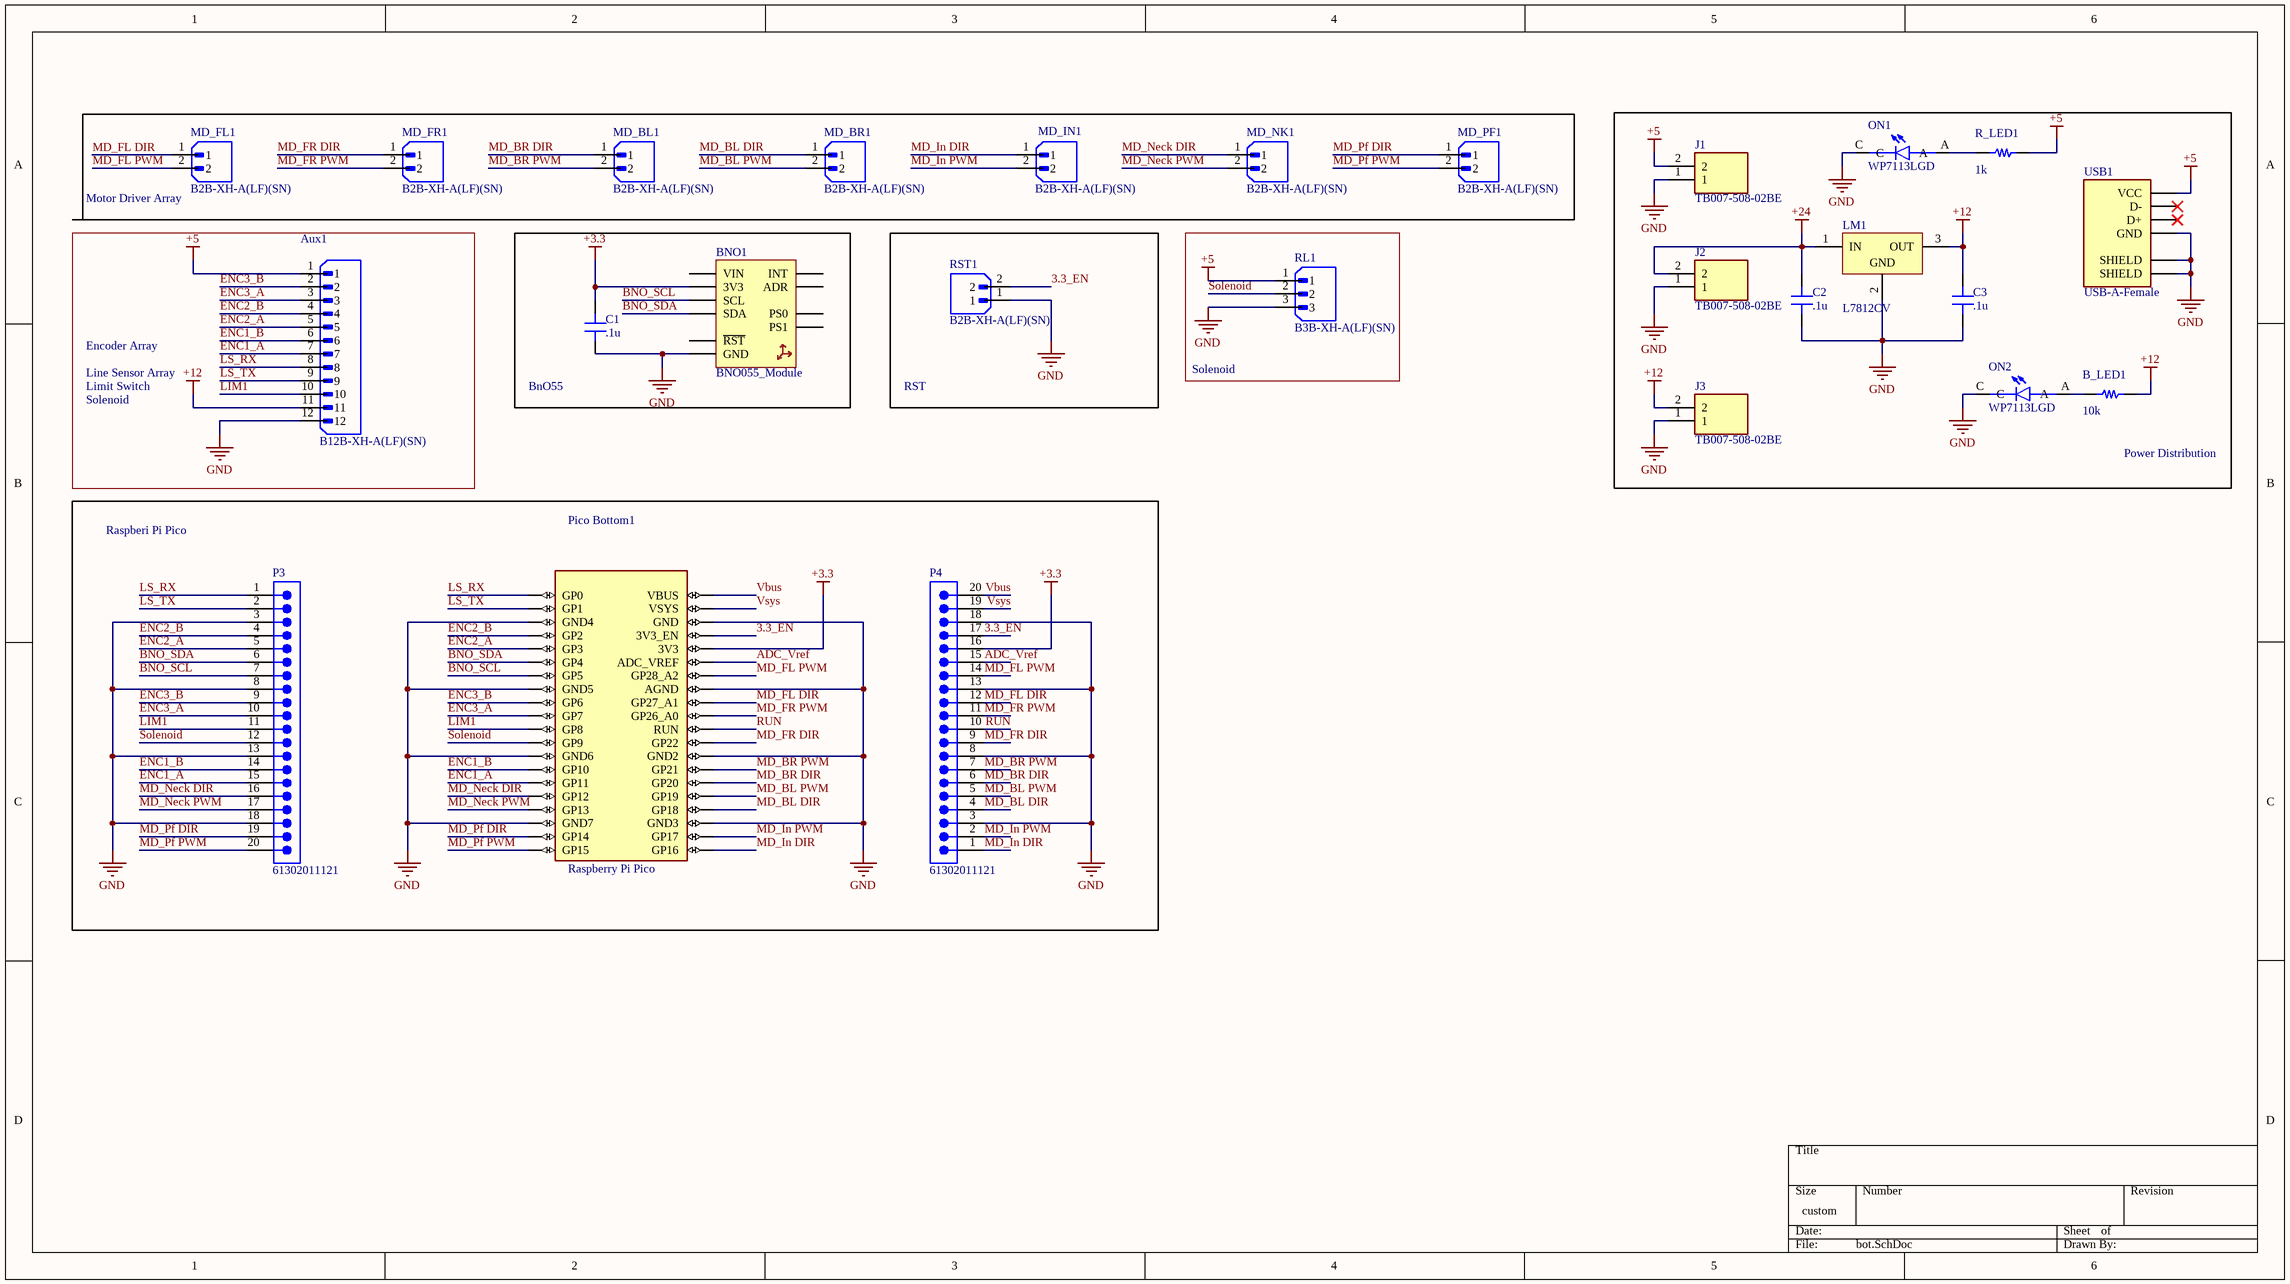
[diagram p7: bot.SchDoc]

### Parts
Aux1  B12B-XH-A(LF)(SN)  [JST_B12B-XH-A(LF)(SN)]
B_LED1  10k  [generic_res_footprint]
BNO1  BNO055_Module  [BNO055_Modiule-Footprint-1]
C1  .1u  [generic_cap]
C2  .1u  [generic_cap]
C3  .1u  [generic_cap]
J1  TB007-508-02BE  [CUI_TB007-508-02BE]
J2  TB007-508-02BE  [CUI_TB007-508-02BE]
J3  TB007-508-02BE  [CUI_TB007-508-02BE]
LM1  L7812CV  [L7812_footprint]
MD_BL1  B2B-XH-A(LF)(SN)  [JST_B2B-XH-A(LF)(SN)]
MD_BR1  B2B-XH-A(LF)(SN)  [JST_B2B-XH-A(LF)(SN)]
MD_FL1  B2B-XH-A(LF)(SN)  [JST_B2B-XH-A(LF)(SN)]
MD_FR1  B2B-XH-A(LF)(SN)  [JST_B2B-XH-A(LF)(SN)]
MD_IN1  B2B-XH-A(LF)(SN)  [JST_B2B-XH-A(LF)(SN)]
MD_NK1  B2B-XH-A(LF)(SN)  [JST_B2B-XH-A(LF)(SN)]
MD_PF1  B2B-XH-A(LF)(SN)  [JST_B2B-XH-A(LF)(SN)]
ON1  WP7113LGD  [LED_WP7113LGD]
ON2  WP7113LGD  [LED_WP7113LGD]
P3  61302011121  [61302011121]
P4  61302011121  [61302011121]
Pico_Bottom1  Raspberry Pi Pico  [RASPBERRY_PI_PICO]
R_LED1  1k  [generic_res_footprint]
RL1  B3B-XH-A(LF)(SN)  [JST_B3B-XH-A(LF)(SN)]
RST1  B2B-XH-A(LF)(SN)  [JST_B2B-XH-A(LF)(SN)]
USB1  USB-A-Female  [CUI_UJ2-AH-4-TH]

### Blocks framed on the sheet
Power Distribution: B_LED1 C2 C3 J1-J3 LM1 ON1 ON2 R_LED1 USB1
BnO55: BNO1 C1
RST: RST1
Solenoid: RL1
Raspberi Pi Pico: P3 P4 Pico_Bottom1

### Nets
+3.3: BNO1.1(3V3) C1.2 P4.16 Pico_Bottom1.3V3
+5: Aux1.1 J1.2 R_LED1.2 RL1.1 USB1.1(VCC)
+12: Aux1.11 B_LED1.2 C3.2 J3.2 LM1.3(OUT)
+24: C2.2 J2.2 LM1.1(IN)
GND: Aux1.12 BNO1.5(GND) C1.1 C2.1 C3.1 J1.1 J2.1 J3.1 LM1.2(GND) ON1.C ON2.C P3.3 P3.8 P3.13 P3.18 P4.3 P4.8 P4.13 P4.18 Pico_Bottom1.AGND Pico_Bottom1.GND Pico_Bottom1.GND2 Pico_Bottom1.GND3 Pico_Bottom1.GND4 Pico_Bottom1.GND5 Pico_Bottom1.GND6 Pico_Bottom1.GND7 RL1.3 RST1.1 USB1.4(GND) USB1.SH1(SHIELD) USB1.SH2(SHIELD)
3.3_EN: P4.17 Pico_Bottom1.3V3_EN RST1.2  [project net 3.3_EN_2]
ADC_Vref: P4.15 Pico_Bottom1.ADC_VREF  [project net ADC_Vref_2]
BNO_SCL: BNO1.2(SCL) P3.7 Pico_Bottom1.GP5  [project net BNO_SCL_2]
BNO_SDA: BNO1.3(SDA) P3.6 Pico_Bottom1.GP4  [project net BNO_SDA_2]
ENC1_A: Aux1.7 P3.15 Pico_Bottom1.GP11  [project net ENC1_A_2]
ENC1_B: Aux1.6 P3.14 Pico_Bottom1.GP10  [project net ENC1_B_2]
ENC2_A: Aux1.5 P3.5 Pico_Bottom1.GP3  [project net ENC2_A_2]
ENC2_B: Aux1.4 P3.4 Pico_Bottom1.GP2  [project net ENC2_B_2]
ENC3_A: Aux1.3 P3.10 Pico_Bottom1.GP7  [project net ENC3_A_2]
ENC3_B: Aux1.2 P3.9 Pico_Bottom1.GP6  [project net ENC3_B_2]
LIM1: Aux1.10 P3.11 Pico_Bottom1.GP8  [project net LIM1_2]
LS_RX: Aux1.8 P3.1 Pico_Bottom1.GP0  [project net LS_RX_2]
LS_TX: Aux1.9 P3.2 Pico_Bottom1.GP1  [project net LS_TX_2]
MD_BL DIR: MD_BR1.1 P4.4 Pico_Bottom1.GP18  [project net MD_BL DIR_2]
MD_BL PWM: MD_BR1.2 P4.5 Pico_Bottom1.GP19  [project net MD_BL PWM_2]
MD_BR DIR: MD_BL1.1 P4.6 Pico_Bottom1.GP20  [project net MD_BR DIR_2]
MD_BR PWM: MD_BL1.2 P4.7 Pico_Bottom1.GP21  [project net MD_BR PWM_2]
MD_FL DIR: MD_FL1.1 P4.12 Pico_Bottom1.GP27_A1  [project net MD_FL DIR_2]
MD_FL PWM: MD_FL1.2 P4.14 Pico_Bottom1.GP28_A2  [project net MD_FL PWM_2]
MD_FR DIR: MD_FR1.1 P4.9 Pico_Bottom1.GP22  [project net MD_FR DIR_2]
MD_FR PWM: MD_FR1.2 P4.11 Pico_Bottom1.GP26_A0  [project net MD_FR PWM_2]
MD_In DIR: MD_IN1.1 P4.1 Pico_Bottom1.GP16  [project net MD_In DIR_2]
MD_In PWM: MD_IN1.2 P4.2 Pico_Bottom1.GP17  [project net MD_In PWM_2]
MD_Neck DIR: MD_NK1.1 P3.16 Pico_Bottom1.GP12  [project net MD_Neck DIR_2]
MD_Neck PWM: MD_NK1.2 P3.17 Pico_Bottom1.GP13  [project net MD_Neck PWM_2]
MD_Pf DIR: MD_PF1.1 P3.19 Pico_Bottom1.GP14  [project net MD_Pf DIR_2]
MD_Pf PWM: MD_PF1.2 P3.20 Pico_Bottom1.GP15  [project net MD_Pf PWM_2]
RUN: P4.10 Pico_Bottom1.RUN  [project net RUN_2]
Solenoid: P3.12 Pico_Bottom1.GP9 RL1.2  [project net Solenoid_2]
Vbus: P4.20 Pico_Bottom1.VBUS  [project net Vbus_2]
Vsys: P4.19 Pico_Bottom1.VSYS  [project net Vsys_2]
NetB_LED1_1: B_LED1.1 ON2.A
NetON1_A: ON1.A R_LED1.1

Not connected (* = marked no-connect by the designer): BNO1 0(VIN) 4(~{RST}) 6(INT) 7(ADR) 8(PS0) 9(PS1); USB1 2(D-)* 3(D+)*

### Notes on the sheet
- (near MD_FL1) Motor Driver Array
- Encoder Array
- Line Sensor Array
- Solenoid
- Limit Switch

### Library data of the parts
Aux1 = CMP-398-000513-1: as Aux2 on sheet bot_aux; Package: None; SnapEDA_Link: https://www.snapeda.com/parts/B12B-XH-A(LF)(SN)/JST+Sales+America+Inc./view-part/?ref=snap; Source: B12B-XH-A(LF)(SN).SchLib; Check_prices: https://www.snapeda.com/parts/B12B-XH-A(LF)(SN)/JST+Sales+America+Inc./view-part/?ref=eda; Value: *; Design Item ID: B12B-XH-A(LF)(SN); MP: B12B-XH-A(LF)(SN); Pin Count: 12; Component Type: Standard
B_LED1 R_LED1 = CMP-340-000000-2: Generic through hole resistor
BNO1 = CMP-00055-2: Module for Bosch BNO055 9 axis precision IMU
C1-C3 = CMP-396-000000-3: as C4 on sheet top; Price: None; Package: None; Value: *; Source: RDER71H472K0K1H03B.SchLib; Design Item ID: RDER71H472K0K1H03B; Pin Count: 2; Component Type: Standard; Availability: Unavailable
J1-J3 = CMP-390-000000-3: as J4 on sheet top; Source: TB007-508-02BE.SchLib; Component Type: Standard; Design Item ID: TB007-508-02BE; Availability: Unavailable; Value: *; Price: None; Pin Count: 2; MP: TB007-508-02BE; Package: None
LM1 = CMP-00056-1: Fixed Positive Standard Regulator, 12V BIPolar, PSFM3; Regulator Type: FIXED POSITIVE SINGLE OUTPUT STANDARD REGULATOR; Surface Mount: No; Output Voltage1-Min: 11.4V; Min Input Voltage: 14.5V; Channels: 1; Output Current1-Max: 1.5A; Output Voltage1-Max: 12.6V; Max Supply Voltage: 30V; Qualification Status: Not Qualified; Terminal Finish: Tin; Operating Temperature, TJ-Min: 0°C; Reach SVHC Compliant: No; Pins: 3; Terminal Form: Through Hole; Terminal Position: SINGLE; Package Style: FLANGE MOUNTMeter; Technology: BIPOLAR; Operating Temperature, TJ-Max: 125°C; Output Voltage1-Nom: 12V; Package Shape: Rectangular; RoHS Compliant: Yes
MD_BL1 MD_BR1 MD_FL1 MD_FR1 MD_IN1 MD_NK1 MD_PF1 RST1 = CMP-332-000000-1: as LIM1 on sheet bot_aux; Component Type: Standard; Value: *; Check_prices: https://www.snapeda.com/parts/B2B-XH-A(LF)(SN)/JST+Sales+America+Inc./view-part/?ref=eda; Package: None; MP: B2B-XH-A(LF)(SN); SnapEDA_Link: https://www.snapeda.com/parts/B2B-XH-A(LF)(SN)/JST+Sales+America+Inc./view-part/?ref=snap; Pin Count: 2; Source: B2B-XH-A(LF)(SN).SchLib; Design Item ID: B2B-XH-A(LF)(SN)
ON1 ON2 = CMP-352-000000-1: as ON3 on sheet bot_aux; Value: *; Component Type: Standard; Design Item ID: WP7113LGD; Package: Radial Kingbright; Price: None; Source: WP7113LGD.SchLib; SnapEDA_Link: https://www.snapeda.com/parts/WP7113LGD/Kingbright/view-part/?ref=snap; Check_prices: https://www.snapeda.com/parts/WP7113LGD/Kingbright/view-part/?ref=eda; Pin Count: 2; Availability: In Stock; Purchase-URL: https://pricing.snapeda.com/search/part/WP7113LGD/?ref=eda; MP: WP7113LGD
P3 P4 = CMP-398-000243-1: as P1 on sheet top; ComponentLink2URL: https://www.we-online.com/redexpert/spec/61302011121?ad; Packaging: Bag; Orientation: Vertical; Match Code: WR-PHD; Number of Pins: 20; Number of Rows: 1; Gender: Pin Header; Source: WR-PHD.SchLib; Design Item ID: 61302011121; ComponentLink1Description: Website Link; Operating Temperature Min: -40°C; Manufacturer Part Number: 61302011121; ComponentLink2Description: Datasheet Link; ComponentLink1URL: https://www.we-online.com/redexpert/article/61302011121?ad; Operating Temperature Max: 105°C; Component Type: Standard; Mount: Through Hole; Category: Board-to-Board Connectors; Pin Count: 20; Pitch: 2.54mm
Pico_Bottom1 = CMP-394-000000-2: Raspberry Pi Board, Arm Cortex-M0+; Component Type: Standard; MF: Raspberry Pi; Design Item ID: RASPBERRY_PI_PICO; MP: RASPBERRY PI PICO; SnapEDA_Link: https://www.snapeda.com/parts/RASPBERRY%20PI%20PICO/Raspberry+Pi/view-part/?ref=snap; Check_prices: https://www.snapeda.com/parts/RASPBERRY%20PI%20PICO/Raspberry+Pi/view-part/?ref=eda; Package: None; Source: RASPBERRY_PI_PICO.SchLib; Pin Count: 40; Value: *
RL1 = CMP-330-000000-1: as BCK1 on sheet top_aux_r; Value: *; Check_prices: https://www.snapeda.com/parts/B3B-XH-A(LF)(SN)/JST+Sales+America+Inc./view-part/?ref=eda; Component Type: Standard; Source: B3B-XH-A(LF)(SN).SchLib; MP: B3B-XH-A(LF)(SN); Design Item ID: B3B-XH-A(LF)(SN); SnapEDA_Link: https://www.snapeda.com/parts/B3B-XH-A(LF)(SN)/JST+Sales+America+Inc./view-part/?ref=snap; Pin Count: 3; Package: None
USB1 = CMP-346-000000-8: Type A, USB 2.0, 1 A, Right Angle, Through Hole, USB Receptacle; MF: CUI Devices; Pin Count: 6; Check_prices: https://www.snapeda.com/parts/UJ2-AH-4-TH/CUI+Devices/view-part/?ref=eda; Purchase-URL: https://pricing.snapeda.com/search/part/UJ2-AH-4-TH/?ref=eda; Package: None; Value: *; Component Type: Standard; MP: UJ2-AH-4-TH; Digi-Key_Part_Number: 102-3994-ND; Source: UJ2-AH-4-TH.SchLib; CUI_purchase_URL: https://www.cuidevices.com/product/interconnect/connectors/usb-connectors/uj2-ah-4-th?utm_source=snapeda.com&utm_medium=referral&utm_campaign=snapedaBOM; SnapEDA_Link: https://www.snapeda.com/parts/UJ2-AH-4-TH/CUI+Devices/view-part/?ref=snap; Design Item ID: UJ2-AH-4-TH

## Nets that join several sheets
+3.3: top_aux_r (5 pins), top (9 pins), bot (BNO1.1 C1.2 P4.16 Pico_Bottom1.3V3)
+5: bot_aux (5 pins), upgrade (8 pins), top_aux_r (5 pins), top (6 pins), top_aux_l (6 pins), bot (5 pins)
+12: bot_aux (Aux2.11 LS1.2), bot (5 pins)
GND: bot_aux (7 pins), upgrade (14 pins), top_aux_r (7 pins), top (29 pins), top_aux_l (10 pins), bot (32 pins)